# Altium schematic sheet MotorController.schdoc: Контроллер двигателя
size 420 x 297 mm; ApprovedBy: Алексеев; CheckedBy: Алексеев; DrawnBy: Подлесный; DocumentNumber: КПТВ.758345.016 Э3; SheetTotal: 1; Title1str: (при необходимости вторая строка); DocumentType: Схема электрическая принципиальная; Format: A3; ImagePath: КПТВ.758345.016
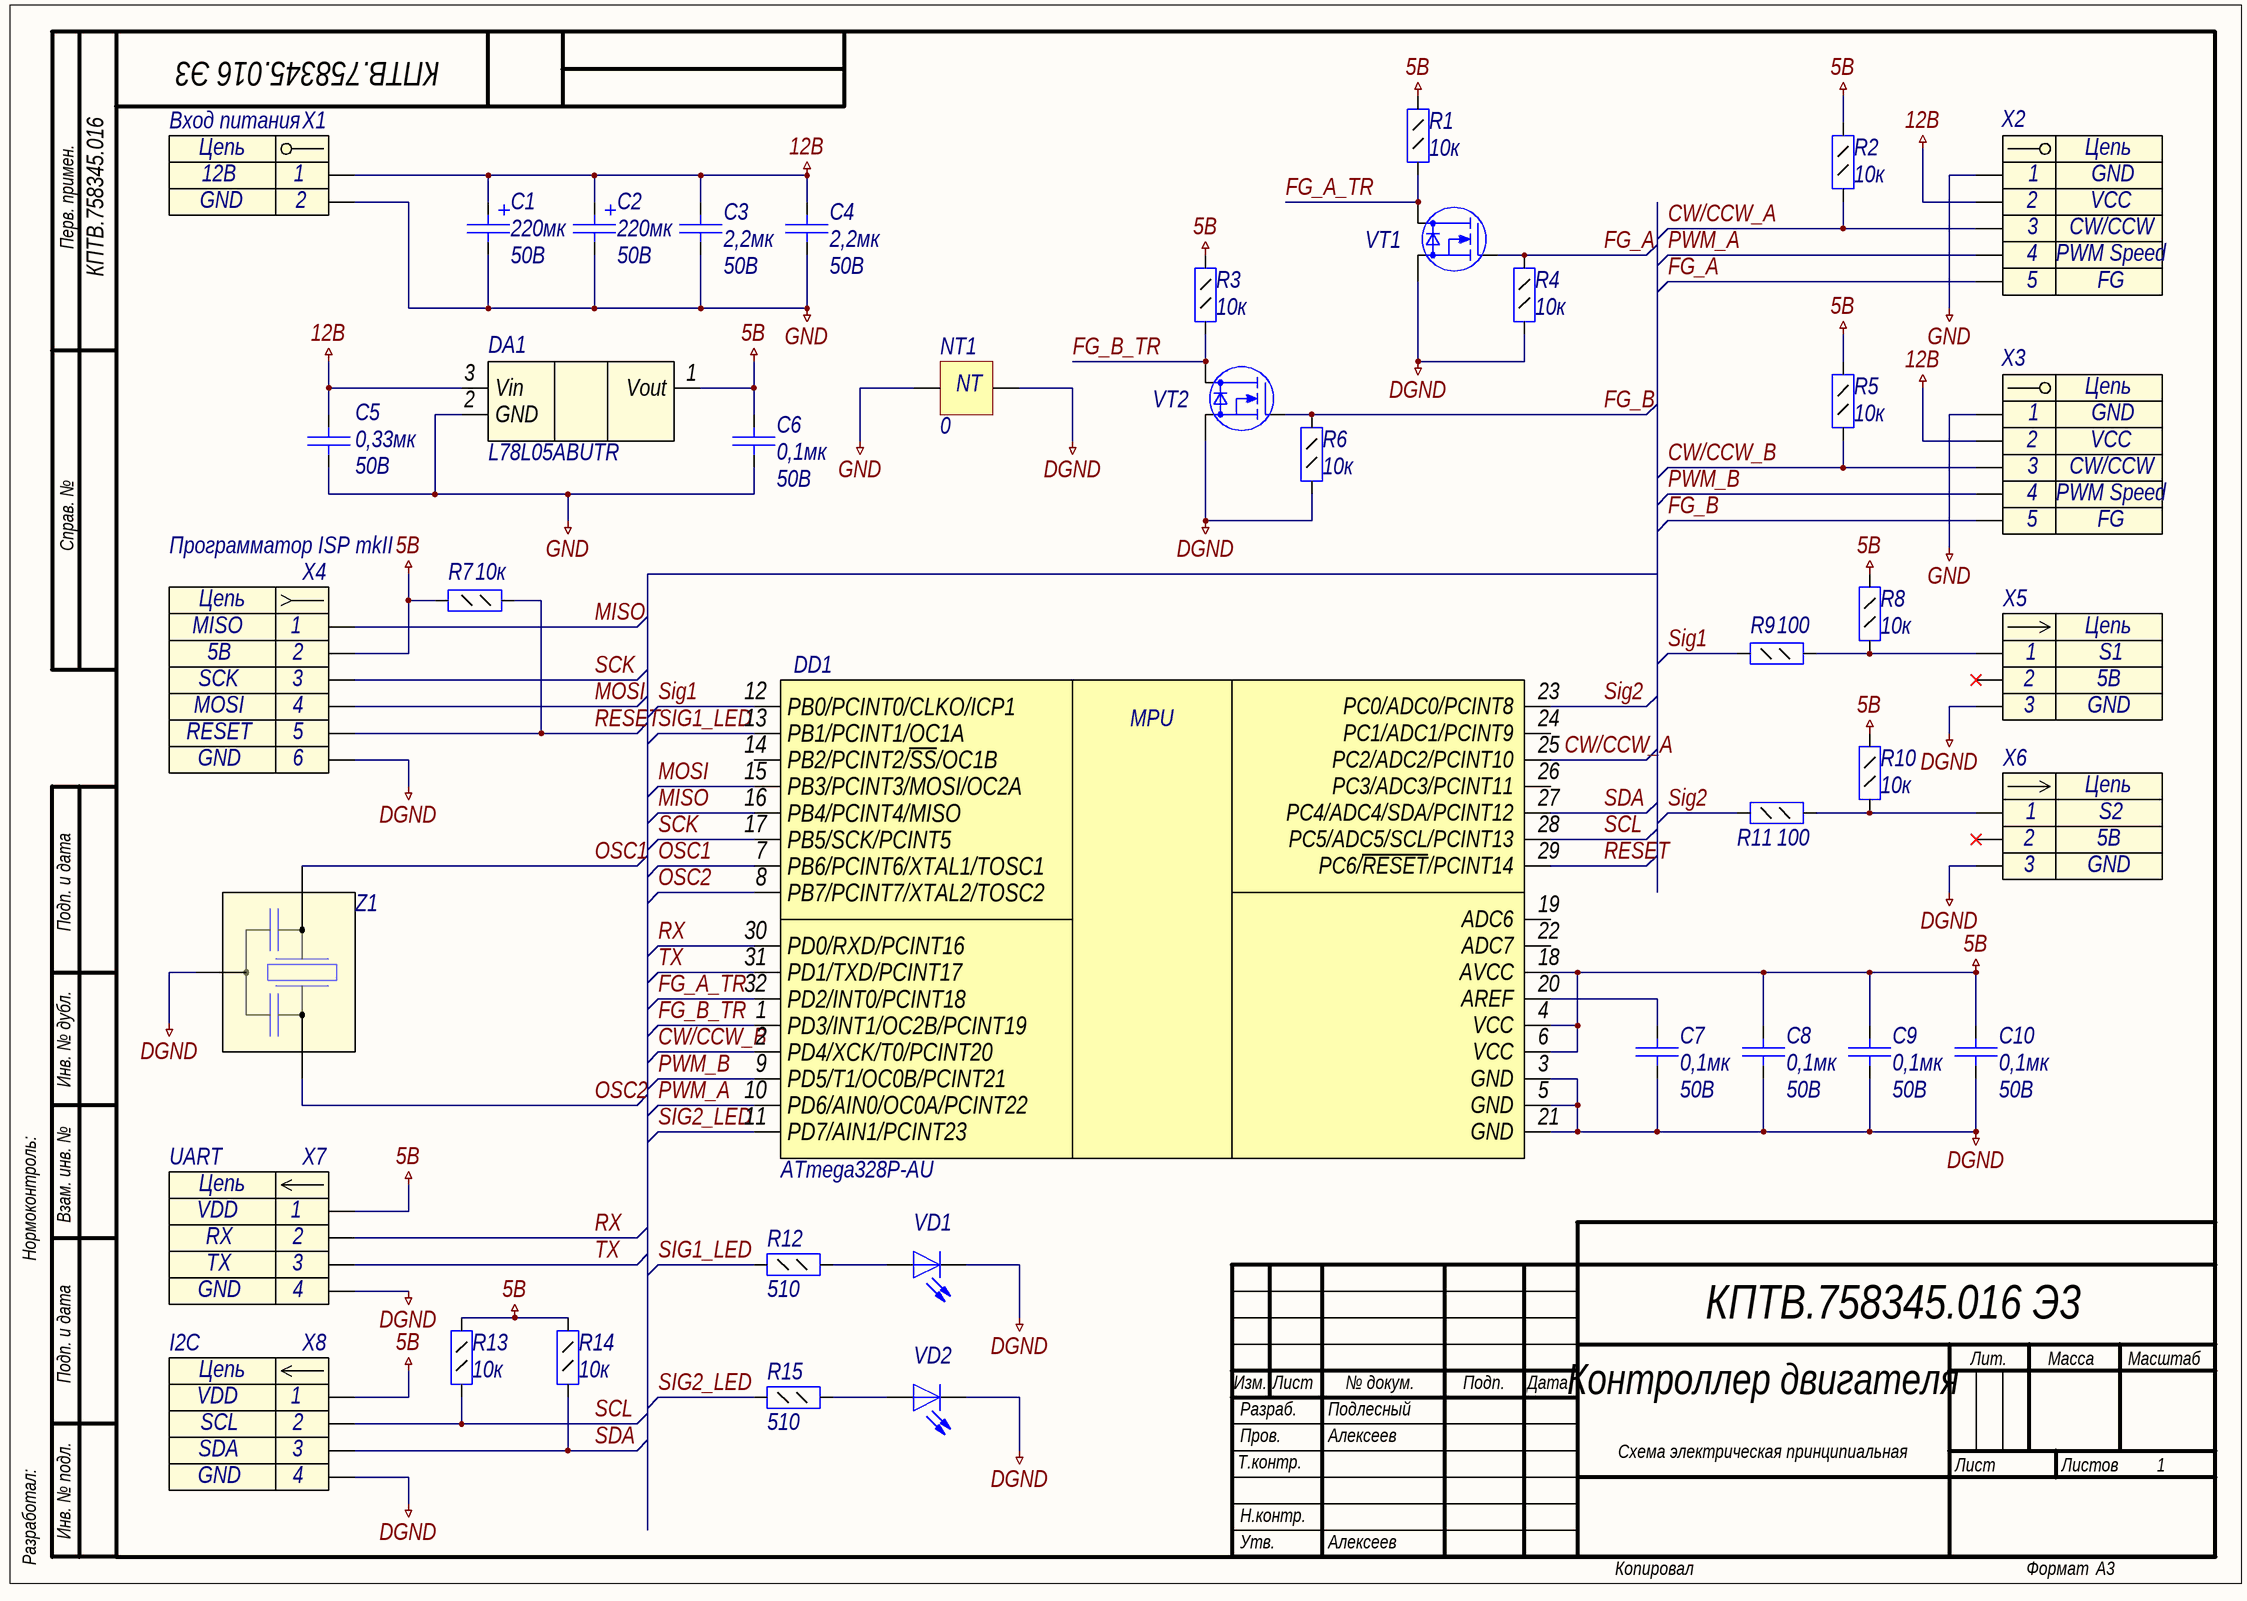
[diagram p0: MotorController.schdoc]

## Parts
C1  value 220мк  Voltage: 50В  [Cap_SMD_radial_polar(10x10.5)]  (hidden comment: Capacitor_pol)
C2  value 220мк  Voltage: 50В  [Cap_SMD_radial_polar(10x10.5)]  (hidden comment: Capacitor_pol)
C3  value 2,2мк  Voltage: 50В  [C1206]  (hidden comment: Capacitor)
C4  value 2,2мк  Voltage: 50В  [C1206]  (hidden comment: Capacitor)
C5  value 0,33мк  Voltage: 50В  [C1206]  (hidden comment: Capacitor)
C6  value 0,1мк  Voltage: 50В  [C0805]  (hidden comment: Capacitor)
C7  value 0,1мк  Voltage: 50В  [C0805]  (hidden comment: Capacitor)
C8  value 0,1мк  Voltage: 50В  [C0805]  (hidden comment: Capacitor)
C9  value 0,1мк  Voltage: 50В  [C0805]  (hidden comment: Capacitor)
C10  value 0,1мк  Voltage: 50В  [C0805]  (hidden comment: Capacitor)
DA1  L78L05ABUTR  [SOT-89-3]
DD1  ATmega328P-AU  [TQFP-32]
NT1  value 0  [Pofigistor0603]  (net tie, no BOM)
R1  value 10к  [R0805]  (hidden comment: Resistor_0,125Вт)
R2  value 10к  [R0805]  (hidden comment: Resistor_0,125Вт)
R3  value 10к  [R0805]  (hidden comment: Resistor_0,125Вт)
R4  value 10к  [R0805]  (hidden comment: Resistor_0,125Вт)
R5  value 10к  [R0805]  (hidden comment: Resistor_0,125Вт)
R6  value 10к  [R0805]  (hidden comment: Resistor_0,125Вт)
R7  value 10к  [R0805]  (hidden comment: Resistor_0,125Вт)
R8  value 10к  [R0805]  (hidden comment: Resistor_0,125Вт)
R9  value 100  [R0805]  (hidden comment: Resistor_0,125Вт)
R10  value 10к  [R0805]  (hidden comment: Resistor_0,125Вт)
R11  value 100  [R0805]  (hidden comment: Resistor_0,125Вт)
R12  value 510  [R0805]  (hidden comment: Resistor_0,125Вт)
R13  value 10к  [R0805]  (hidden comment: Resistor_0,125Вт)
R14  value 10к  [R0805]  (hidden comment: Resistor_0,125Вт)
R15  value 510  [R0805]  (hidden comment: Resistor_0,125Вт)
VD1  LED  [L_0805]  (value not drawn)
VD2  LED  [L_0805]  (value not drawn)
VT1  N-MOSFET  [SOT23-3]  (value not drawn)
VT2  N-MOSFET  [SOT23-3]  (value not drawn)
X1  Вход питания  [TERMINAL-2WAY-3.5MM]
X2  Header_5_trm  [TERMINAL-5WAY-3.5MM_]  (value not drawn)
X3  Управление двигателем B  [TERMINAL-5WAY-3.5MM]  (value not drawn)
X4  Программатор ISP mkII  [PLS2-6]
X5  Header_3_plg  [PLS-3]  (value not drawn)
X6  Header_3_plg  [PLS-3]  (value not drawn)
X7  UART  [PLS-4]
X8  I2C  [PLS-4]
Z1  QuartzWithCaps  [CSTCE]  (value not drawn)

## Nets
5B: C6.2 C8.2 C9.2 C10.2 DA1.1(Vout) DD1.4(VCC) DD1.6(VCC) DD1.18(AVCC) R1.1 R2.1 R3.1 R5.1 R7.2 R8.1 R10.1 R13.1 R14.1 X4.2 X7.1 X8.1
12B: C1.1 C2.1 C3.2 C4.2 C5.2 DA1.3(Vin) X1.1 X2.2 X3.2
DGND: C7.1 C8.1 C9.1 C10.1 DD1.3(GND) DD1.5(GND) DD1.21(GND) NT1.2 R4.2 R6.2 VD1.1(K) VD2.1(K) VT1.3(S) VT2.3(S) X4.6 X5.3 X6.3 X7.4 X8.4 Z1.2
GND: C1.2 C2.2 C3.1 C4.1 C5.1 C6.1 DA1.2(GND) NT1.1 X1.2 X2.1 X3.1
CW/CCW_A: DD1.25(PC2/ADC2/PCINT10) R2.2 X2.3
CW/CCW_B: DD1.2(PD4/XCK/T0/PCINT20) R5.2 X3.3
FG_A: R4.1 VT1.1(G) X2.5
FG_A_TR: DD1.32(PD2/INT0/PCINT18) R1.2 VT1.2(D)
FG_B: R6.1 VT2.1(G) X3.5
FG_B_TR: DD1.1(PD3/INT1/OC2B/PCINT19) R3.2 VT2.2(D)
MISO: DD1.16(PB4/PCINT4/MISO) X4.1
MOSI: DD1.15(PB3/PCINT3/MOSI/OC2A) X4.4
OSC1: DD1.7(PB6/PCINT6/XTAL1/TOSC1) Z1.3
OSC2: DD1.8(PB7/PCINT7/XTAL2/TOSC2) Z1.1
PWM_A: DD1.10(PD6/AIN0/OC0A/PCINT22) X2.4
PWM_B: DD1.9(PD5/T1/OC0B/PCINT21) X3.4
RESET: DD1.29(PC6/~{RESET}/PCINT14) R7.1 X4.5
RX: DD1.30(PD0/RXD/PCINT16) X7.2
SCK: DD1.17(PB5/SCK/PCINT5) X4.3
SCL: DD1.28(PC5/ADC5/SCL/PCINT13) R13.2 X8.2
SDA: DD1.27(PC4/ADC4/SDA/PCINT12) R14.2 X8.3
Sig1: DD1.12(PB0/PCINT0/CLKO/ICP1) R9.1
SIG1_LED: DD1.13(PB1/PCINT1/OC1A) R12.1
Sig2: DD1.23(PC0/ADC0/PCINT8) R11.1
SIG2_LED: DD1.11(PD7/AIN1/PCINT23) R15.1
TX: DD1.31(PD1/TXD/PCINT17) X7.3
NetC7_2: C7.2 DD1.20(AREF)
NetR8_2: R8.2 R9.2 X5.1
NetR10_2: R10.2 R11.2 X6.1
NetR12_2: R12.2 VD1.2(A)
NetR15_2: R15.2 VD2.2(A)

Not connected (* = marked no-connect by the designer): DD1 14(PB2/PCINT2/~{SS}/OC1B) 19(ADC6) 22(ADC7) 24(PC1/ADC1/PCINT9) 26(PC3/ADC3/PCINT11); X5 2*; X6 2*

## Notes on the sheet
- Перв. примен.
- Справ. №
- Подп. и дата
- Инв. № дубл.
- Нормоконтроль:
- Взам. инв. №
- Изм.
- Лист
- № докум.
- Подп.
- Дата
- Лит.
- Масса
- Масштаб
- Т.контр.
- Пров.
- Разраб.
- Листов
- Разработал:
- Инв. № подл.
- Н.контр.
- Утв.
- Копировал
- Формат
- (in symbol connect0) Цепь
- (in symbol connect14) Цепь
- (in symbol connect33) Цепь
- (in symbol connect34) Цепь
- (in symbol connect59) Цепь
- (in symbol connect60) Цепь
- (in symbol microcont1) MPU
- (in symbol res1930) NT

## Library data of the parts
C1 C2 = cap195: Конденсатор полярный; Part Name: Capacitors_pol; Part Number: ECAP SMD; id: cap195
C3 C4 = cap188: Конденсатор; Part Name: Capacitors; Part Number: GRM31CR71H225KA88**L; id: cap188; TKE: X7R
C5 = cap183: Конденсатор; Part Name: Capacitors; Part Number: GRM319R71H334K; id: cap183; TKE: X7R
C6-C10 = cap161: Конденсатор; Part Name: Capacitors; Part Number: GRM21BR71H104KA01L; id: cap161; TKE: X7R
DA1 = pwr6: Cтабилизатор напряжения (+5В; 0.1А), 4%, (-40...+125C); Part Name: Positive voltage regulators; Manufacturer: ST Microelectronics; id: pwr6; Input Voltage: 40B; Output Voltage: 5B; Current: 0,1A; Type: Linear; Part Number: L78L05ABUTR
DD1 = microcont1: Микроконтроллер 8-Бит, picoPower, AVR, 20МГц, 32КБ Flash; Part Name: Microcontroller; Frequency: 20MHz; ADC: 8x10b; Interface: i2c, spi, uart; Flash: 32kb; Pin in: 23; Power Supply: 1.8-5.5 V; id: microcont1; Part Number: ATmega328P-AU
NT1 = res1930: id: res1930; Part Name: Pofigistor
R1-R8 R10 R13 R14 = res97: Резистор; id: res97; Accuracy: 1%; Part Name: Resistor; Power: 0,125Вт
R9 R11 = res49: Резистор; id: res49; Accuracy: 1%; Part Name: Resistor; Power: 0,125Вт
R12 R15 = res66: Резистор; Manufacture: Yageo; Part Number: RC0805FR-07510RL; id: res66; Accuracy: 0,01; Part Name: Resistor; Power: 0,125Вт
VD1 VD2 = diode8: Светодиод; Part Number: KP-2012EC; id: diode8; Part Name: LED
VT1 VT2 = trans2: Part Number: IRLML2402TRPBF; Manufacturer: International Rectifier; id: trans2; Structure: n-channel; V drain-source max: 20B; Rds: 0,25Ohm; Gate-to-source voltage: (+-)12B; Continuous drain current: 1,2A; Pulsed drain current: 7,4A; Power dissipation: 0,54W
X1 = connect34: Разъем - 2 конт. клеммник; Part Name: TERMINAL BLOCK 2 way; Contact_1: 12В; Contact_2: GND; Etch: 3.5mm; id: connect34
X2 = connect60: Разъем - 5 конт. клеммник; Part Name: TERMINAL BLOCK 5 way; Contact_1: GND; Contact_2: VCC; Contact_3: CW/CCW; Contact_4: PWM Speed; Contact_5: FG; Etch: 3.5mm; id: connect60
X3 = connect59: Разъем - 5 конт. клеммник; Part Name: TERMINAL BLOCK 5 way; Contact_1: GND; Contact_2: VCC; Contact_3: CW/CCW; Contact_4: PWM Speed; Contact_5: FG; Etch: 3.5mm; id: connect59
X4 = connect0: Разъем - 6 конт. розетка; Contact_1: MISO; Contact_2: 5B; Contact_3: SCK; Contact_4: MOSI; Contact_5: RESET; Contact_6: GND; Part Name: MKII; id: connect0
X5 = connect33: Разъем - 3 конт. вилка; Part Number: DS1021-1*3SF112-B; Manufacture: Ningbo connfly electronic; Contact_1: S1; Contact_2: 5B; Contact_3: GND; Etch: 2,54mm; Part Name: PLS-3; id: connect33
X6 = connect33: Разъем - 3 конт. вилка; Part Number: DS1021-1*3SF112-B; Manufacture: Ningbo connfly electronic; Contact_1: S2; Contact_2: 5B; Contact_3: GND; Etch: 2,54mm; Part Name: PLS-3; id: connect33
X7 = connect14: Разъем - 4 конт. вилка; Part Number: DS1021-1*4SF112-B; Manufacture: Ningbo connfly electronic; Contact_1: VDD; Contact_2: RX; Contact_3: TX; Contact_4: GND; Etch: 2,54mm; Part Name: PLS-4; id: connect14
X8 = connect14: Разъем - 4 конт. вилка; Part Number: DS1021-1*4SF112-B; Manufacture: Ningbo connfly electronic; Contact_1: VDD; Contact_2: SCL; Contact_3: SDA; Contact_4: GND; Etch: 2,54mm; Part Name: PLS-4; id: connect14
Z1 = crystal5: Кварцевый резорнатор со встроенными нагрузочными конденсаторами; Manufacture: Murata; Part Number: CSTCE12M0G52-R0; Frequence: 12MHz; id: crystal5